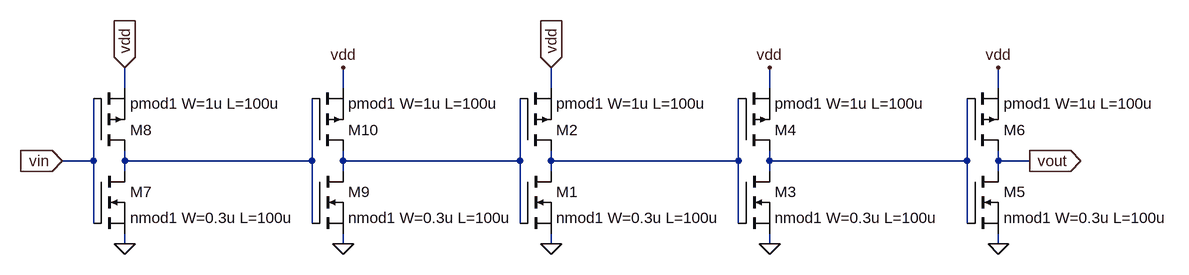
[diagram p0: schematic INV.asc]
INV.asc, the LTspice schematic file:
Version 4
SHEET 1 1116 680
WIRE -704 -288 -704 -320
WIRE -368 -288 -368 -320
WIRE -48 -288 -48 -320
WIRE 288 -288 288 -320
WIRE 640 -288 640 -320
WIRE -752 -176 -752 -272
WIRE -752 -176 -800 -176
WIRE -704 -176 -704 -192
WIRE -416 -176 -416 -272
WIRE -416 -176 -704 -176
WIRE -368 -176 -368 -192
WIRE -96 -176 -96 -272
WIRE -96 -176 -368 -176
WIRE -48 -176 -48 -192
WIRE 240 -176 240 -272
WIRE 240 -176 -48 -176
WIRE 288 -176 288 -192
WIRE 592 -176 592 -272
WIRE 592 -176 288 -176
WIRE 640 -176 640 -192
WIRE 688 -176 640 -176
WIRE -704 -160 -704 -176
WIRE -368 -160 -368 -176
WIRE -48 -160 -48 -176
WIRE 288 -160 288 -176
WIRE 640 -160 640 -176
WIRE -752 -80 -752 -176
WIRE -416 -80 -416 -176
WIRE -96 -80 -96 -176
WIRE 240 -80 240 -176
WIRE 592 -80 592 -176
WIRE -704 -48 -704 -64
WIRE -368 -48 -368 -64
WIRE -48 -48 -48 -64
WIRE 288 -48 288 -64
WIRE 640 -48 640 -64
FLAG -48 -48 0
FLAG -48 -320 vdd
IOPIN -48 -320 In
FLAG -800 -176 vin
IOPIN -800 -176 In
FLAG 688 -176 vout
IOPIN 688 -176 Out
FLAG 288 -48 0
FLAG 288 -320 vdd
FLAG 640 -48 0
FLAG 640 -320 vdd
FLAG -704 -48 0
FLAG -704 -320 vdd
IOPIN -704 -320 In
FLAG -368 -48 0
FLAG -368 -320 vdd
SYMBOL nmos -96 -160 R0
SYMATTR InstName M1
SYMATTR Value nmod1 W=0.3u L=100u
SYMBOL pmos -96 -192 M180
SYMATTR InstName M2
SYMATTR Value pmod1 W=1u L=100u
SYMBOL nmos 240 -160 R0
SYMATTR InstName M3
SYMATTR Value nmod1 W=0.3u L=100u
SYMBOL pmos 240 -192 M180
SYMATTR InstName M4
SYMATTR Value pmod1 W=1u L=100u
SYMBOL nmos 592 -160 R0
SYMATTR InstName M5
SYMATTR Value nmod1 W=0.3u L=100u
SYMBOL pmos 592 -192 M180
SYMATTR InstName M6
SYMATTR Value pmod1 W=1u L=100u
SYMBOL nmos -752 -160 R0
SYMATTR InstName M7
SYMATTR Value nmod1 W=0.3u L=100u
SYMBOL pmos -752 -192 M180
SYMATTR InstName M8
SYMATTR Value pmod1 W=1u L=100u
SYMBOL nmos -416 -160 R0
SYMATTR InstName M9
SYMATTR Value nmod1 W=0.3u L=100u
SYMBOL pmos -416 -192 M180
SYMATTR InstName M10
SYMATTR Value pmod1 W=1u L=100u

The netlist it stands for:
* INV.asc
M1 N003 N002 0 0 nmod1 W=0.3u L=100u
M2 N003 N002 vdd vdd pmod1 W=1u L=100u
M3 N004 N003 0 0 nmod1 W=0.3u L=100u
M4 N004 N003 vdd vdd pmod1 W=1u L=100u
M5 vout N004 0 0 nmod1 W=0.3u L=100u
M6 vout N004 vdd vdd pmod1 W=1u L=100u
M7 N001 vin 0 0 nmod1 W=0.3u L=100u
M8 N001 vin vdd vdd pmod1 W=1u L=100u
M9 N002 N001 0 0 nmod1 W=0.3u L=100u
M10 N002 N001 vdd vdd pmod1 W=1u L=100u
.model NMOS NMOS
.model PMOS PMOS
.lib standard.mos
.backanno
.end